# Altium schematic sheet Sheet1.SchDoc
size A; SheetNumber: 1; SheetTotal: 1
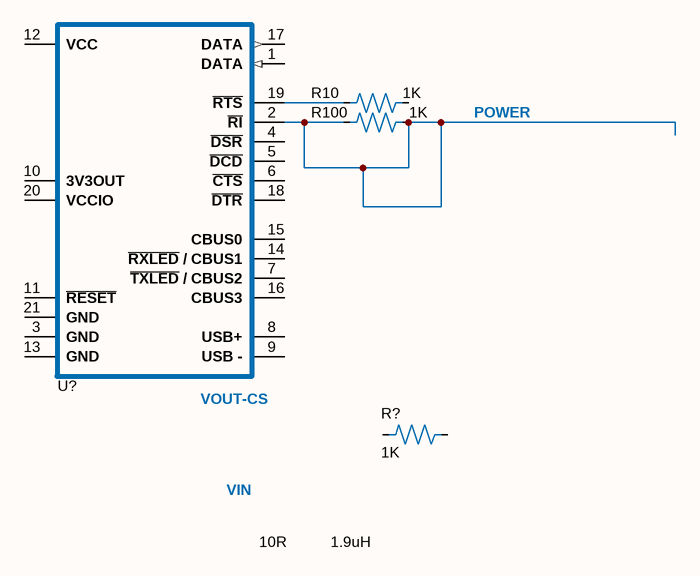
[diagram p0: Sheet1.SchDoc]

## Parts
R10  value 1K  [resistor 0402]  (hidden comment: passive_1)
R100  value 1K  [resistor 0402]  (hidden comment: passive_1)
R?  value 1K  [resistor 0402]  (hidden comment: passive_1)
U?  FTDI  [FT231XQ-R]  (value not drawn)

## Nets
POWER: R100.1 R100.2 U?.2(~{RI})
NetR10_1: R10.1 U?.19(~{RTS})

Not connected (* = marked no-connect by the designer): R10 2; R? 1 2; U? 1(DATA) 3(GND) 4(~{DSR}) 5(~{DCD}) 6(~{CTS}) 7(~{TXLED}_/_CBUS2) 8(USB+) 9(USB_-) 10(3V3OUT) 11(~{RESET}) 12(VCC) 13(GND) 14(~{RXLED}_/_CBUS1) 15(CBUS0) 16(CBUS3) 17(DATA) 18(~{DTR}) 20(VCCIO) 21(GND)

## Notes on the sheet
- Labels drawn without touching a wire or pin: 1.9uH, 10R, VIN, VOUT-CS

## Library data of the parts
R10 R100 R? = passive_1: Resistor 0402
U? = ic_1: USB to UART converter, FTDI, single, 20 pins, QFN; Manufacturer 1: FTDI, Future Technology Devices International Ltd; Supplier 1: Digi-Key; Supplier Part Number 1: 768-1128-1-ND; Manufacturer Part Number 1: FT231XQ-R